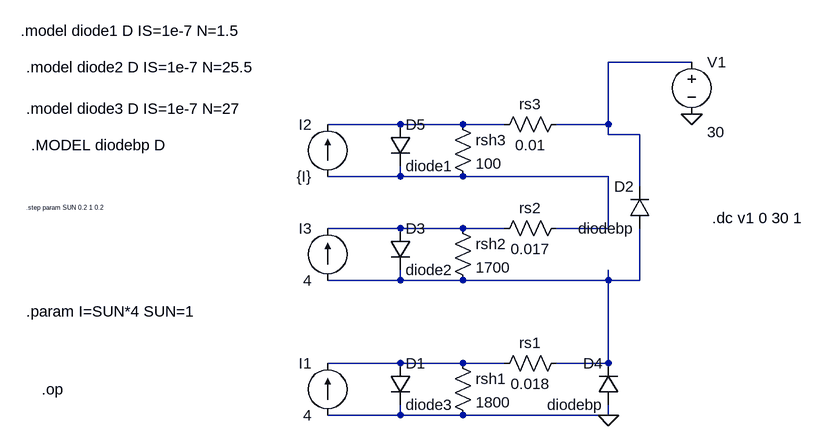
[diagram p0: schematic Draft3.asc]
Draft3.asc, the LTspice schematic file:
Version 4
SHEET 1 1052 756
WIRE 720 192 592 192
WIRE 272 288 160 288
WIRE 368 288 272 288
WIRE 432 288 368 288
WIRE 592 288 592 192
WIRE 592 288 512 288
WIRE 592 304 592 288
WIRE 640 304 592 304
WIRE 272 368 272 352
WIRE 272 368 160 368
WIRE 368 368 272 368
WIRE 592 368 368 368
WIRE 640 384 640 304
WIRE 272 448 160 448
WIRE 368 448 272 448
WIRE 432 448 368 448
WIRE 592 448 592 368
WIRE 592 448 512 448
WIRE 272 528 272 512
WIRE 272 528 160 528
WIRE 368 528 272 528
WIRE 592 528 592 512
WIRE 592 528 368 528
WIRE 640 528 640 448
WIRE 640 528 592 528
WIRE 272 656 160 656
WIRE 368 656 272 656
WIRE 432 656 368 656
WIRE 592 656 592 528
WIRE 592 656 512 656
WIRE 592 672 592 656
WIRE 272 736 272 720
WIRE 272 736 160 736
WIRE 368 736 272 736
WIRE 592 736 592 720
WIRE 592 736 368 736
FLAG 720 272 0
FLAG 592 736 0
SYMBOL voltage 720 176 R0
WINDOW 3 24 152 Left 2
WINDOW 123 0 0 Left 0
WINDOW 39 24 124 Left 2
SYMATTR InstName V1
SYMATTR Value ""
SYMATTR SpiceLine 30
SYMBOL current 160 528 R180
WINDOW 0 24 80 Left 2
WINDOW 3 24 0 Left 2
WINDOW 123 0 0 Left 0
WINDOW 39 0 0 Left 0
SYMATTR InstName I3
SYMATTR Value 4
SYMBOL diode 256 448 R0
SYMATTR InstName D3
SYMATTR Value diode2
SYMBOL res 352 432 R0
SYMATTR InstName rsh2
SYMATTR Value 1700
SYMBOL res 528 432 R90
WINDOW 0 0 56 VBottom 2
WINDOW 3 32 56 VTop 2
SYMATTR InstName rs2
SYMATTR Value 0.017
SYMBOL current 160 736 R180
WINDOW 0 24 80 Left 2
WINDOW 3 24 0 Left 2
WINDOW 123 0 0 Left 0
WINDOW 39 0 0 Left 0
SYMATTR InstName I1
SYMATTR Value 4
SYMBOL diode 256 656 R0
SYMATTR InstName D1
SYMATTR Value diode3
SYMBOL res 352 640 R0
SYMATTR InstName rsh1
SYMATTR Value 1800
SYMBOL res 528 640 R90
WINDOW 0 0 56 VBottom 2
WINDOW 3 32 56 VTop 2
SYMATTR InstName rs1
SYMATTR Value 0.018
SYMBOL diode 608 720 R180
WINDOW 0 24 64 Left 2
WINDOW 3 24 0 Left 2
SYMATTR InstName D4
SYMATTR Value diodebp
SYMBOL current 160 368 R180
WINDOW 0 24 80 Left 2
WINDOW 3 24 0 Left 2
WINDOW 123 0 0 Left 0
WINDOW 39 0 0 Left 0
SYMATTR InstName I2
SYMATTR Value {I}
SYMBOL diode 256 288 R0
SYMATTR InstName D5
SYMATTR Value diode1
SYMBOL res 352 272 R0
SYMATTR InstName rsh3
SYMATTR Value 100
SYMBOL res 528 272 R90
WINDOW 0 0 56 VBottom 2
WINDOW 3 32 56 VTop 2
SYMATTR InstName rs3
SYMATTR Value 0.01
SYMBOL diode 656 448 R180
WINDOW 0 24 64 Left 2
WINDOW 3 24 0 Left 2
SYMATTR InstName D2
SYMATTR Value diodebp
TEXT -312 144 Left 2 !.model diode1 D IS=1e-7 N=1.5
TEXT 752 432 Left 2 !.dc v1 0 30 1
TEXT -304 264 Left 2 !.model diode3 D IS=1e-7 N=27
TEXT -296 320 Left 2 !.MODEL diodebp D
TEXT -304 200 Left 2 !.model diode2 D IS=1e-7 N=25.5
TEXT -304 576 Left 2 !.param I=SUN*4 SUN=1
TEXT -280 696 Left 2 !.op
TEXT -304 416 Left 0 !.step param SUN 0.2 1 0.2

The netlist it stands for:
* Draft3.asc
V1 N001 0 30
I3 N005 N004 4
D3 N004 N005 diode2
rsh2 N004 N005 1700
rs2 N003 N004 0.017
I1 0 N006 4
D1 N006 0 diode3
rsh1 N006 0 1800
rs1 N005 N006 0.018
D4 0 N005 diodebp
I2 N003 N002 {I}
D5 N002 N003 diode1
rsh3 N002 N003 100
rs3 N001 N002 0.01
D2 N005 N001 diodebp
.model D D
.lib standard.dio
.model diode1 D IS=1e-7 N=1.5
.dc v1 0 30 1
.model diode3 D IS=1e-7 N=27
.MODEL diodebp D
.model diode2 D IS=1e-7 N=25.5
.param I=SUN*4 SUN=1
.op
.step param SUN 0.2 1 0.2
.backanno
.end